# Altium schematic sheet RTC.SchDoc
size A4
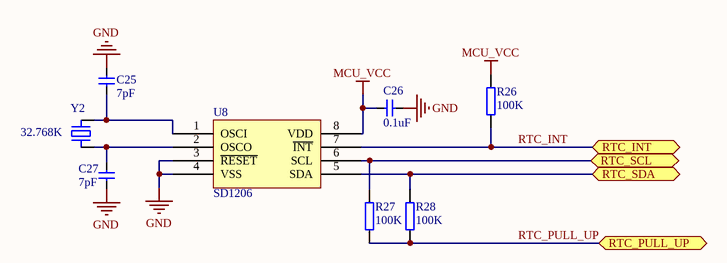
[diagram p0: RTC.SchDoc]

## Parts
C25  7pF  [0603C]
C26  0.1uF  [0603C]
C27  7pF  [0603C]
R26  100K  [0603R]
R27  100K  [0603R]
R28  100K  [0603R]
U8  SD1206  [SOP8]
Y2  32.768K  [3215SMD]

## Ports
RTC_INT, RTC_PULL_UP, RTC_SCL, RTC_SDA

## Nets
GND: C25.1 C26.2 C27.1 U8.3(~{RESET}) U8.4(VSS)
MCU_VCC: C26.1 R26.2 U8.8(VDD)
RTC_INT: R26.1 U8.7(~{INT}) ; port RTC_INT
RTC_PULL_UP: R27.1 R28.1 ; port RTC_PULL_UP
RTC_SCL: R27.2 U8.6(SCL) ; port RTC_SCL
RTC_SDA: R28.2 U8.5(SDA) ; port RTC_SDA
NetC25_2: C25.2 U8.1(OSCI) Y2.1
NetC27_2: C27.2 U8.2(OSCO) Y2.2

## Library data of the parts
C25-C27 = CAP
R26-R28 = RES2A
U8 = PCF8593
Y2 = CRYSTAL_2P: 无源贴片晶振 3215 2脚  FC-135